# Altium schematic sheet Main_Board_Tank.SchDoc
size A4; SheetNumber: 1; SheetTotal: 4
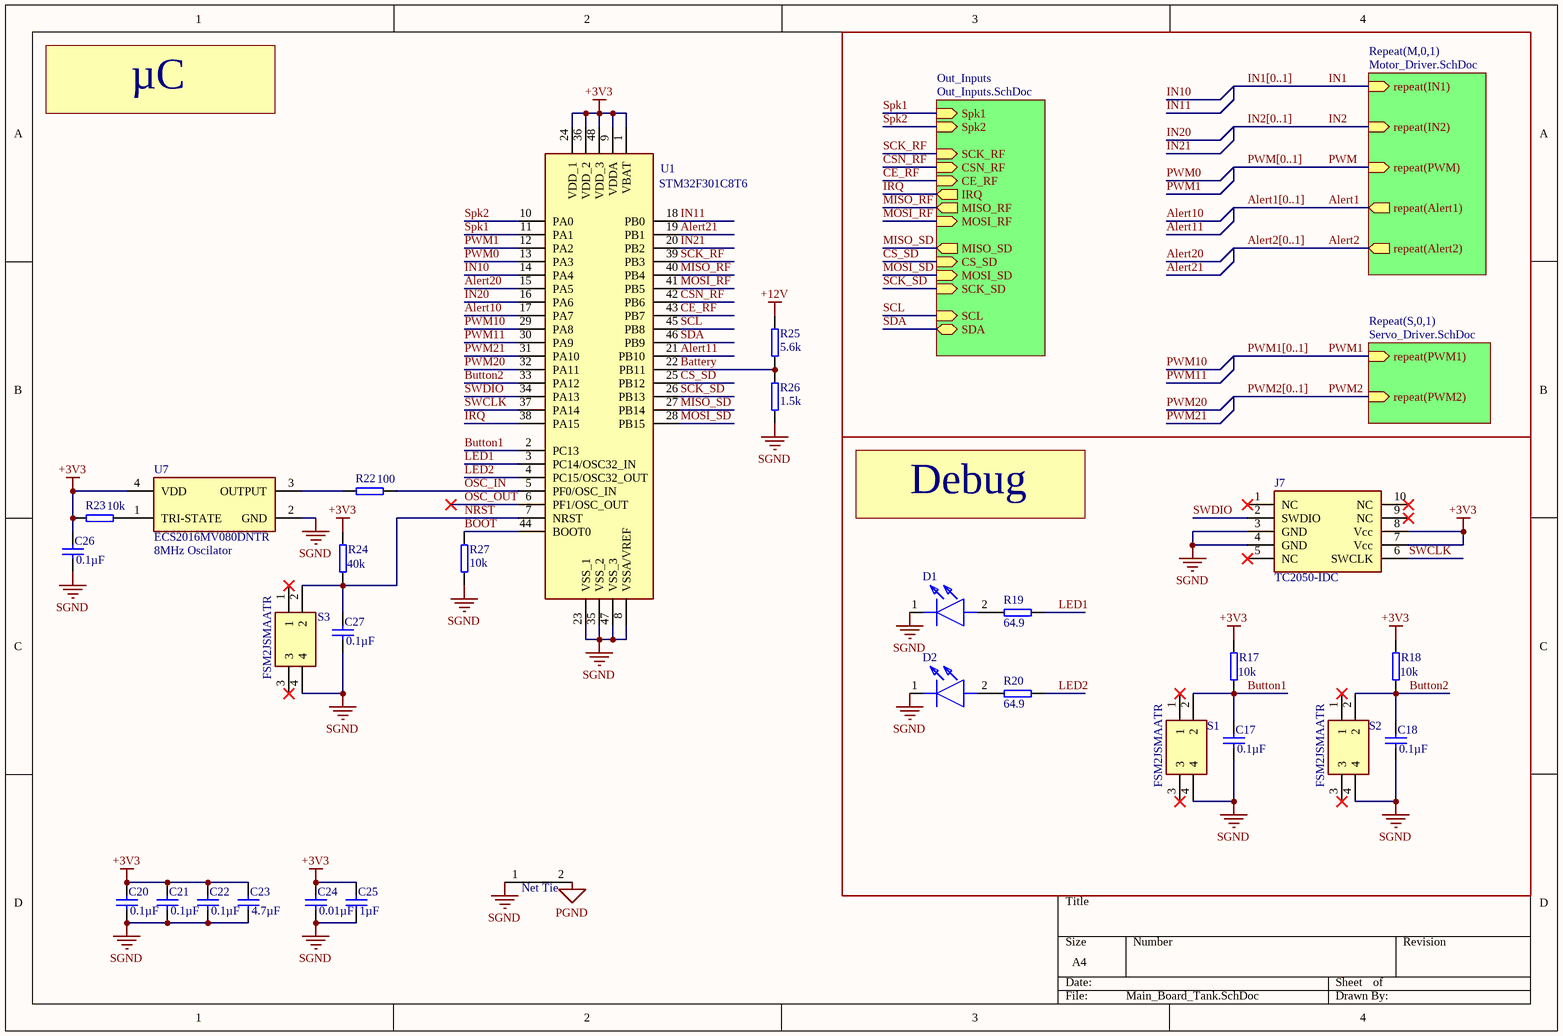
[diagram p0: Main_Board_Tank.SchDoc]

## Parts
C17  0.1µF  [Capacitor 0603]
C18  0.1µF  [Capacitor 0603]
C20  0.1µF  [Capacitor 0603]
C21  0.1µF  [Capacitor 0603]
C22  0.1µF  [Capacitor 0603]
C23  4.7µF  [Capacitor 0603]
C24  0.01µF  [Capacitor 0603]
C25  1µF  [Capacitor 0603]
C26  0.1µF  [Capacitor 0603]
C27  0.1µF  [Capacitor 0603]
D1  LED 1608 (0603) SMD  [INS21AT2G]  (value not drawn)
D2  LED 1608 (0603) SMD  [INS21AT2G]  (value not drawn)
J7  TC2050-IDC  [TAG-CONNECT_TC2050-IDC]
NT1  Net Tie  [Net_Tie]  (net tie, no BOM)
R17  10k  [Resistor 0603]
R18  10k  [Resistor 0603]
R19  64.9  [Resistor 0603]
R20  64.9  [Resistor 0603]
R22  100  [Resistor 0603]
R23  10k  [Resistor 0603]
R24  40k  [Resistor 0603]
R25  5.6k  [Resistor 0603]
R26  1.5k  [Resistor 0603]
R27  10k  [Resistor 0603]
S1  FSM2JSMAATR  [FSM2J_1]
S2  FSM2JSMAATR  [FSM2J_1]
S3  FSM2JSMAATR  [FSM2J_1]
U1  STM32F301C8T6  [QFP50P900X900X160-48N]
U7  ECS2016MV080DNTR  [OSC_ECS-1618-300-BN-TR]

## Blocks framed on the sheet
Debug: C17 C18 D1 D2 J7 R17-R20 S1 S2

## Sub-sheets
Out_Inputs = Out_Inputs.SchDoc: Spk1 (in), Spk2 (in), SCK_RF (in), CSN_RF (in), CE_RF (in), IRQ (out), MISO_RF (out), MOSI_RF (in), MISO_SD (out), CS_SD (in), MOSI_SD (in), SCK_SD (in), SDA (bidir), SCL (in)
Repeat(M,0,1) = Motor_Driver.SchDoc: repeat(IN2) (in), repeat(PWM) (in), repeat(IN1) (in), repeat(Alert1) (out), repeat(Alert2) (out)
Repeat(S,0,1) = Servo_Driver.SchDoc: repeat(PWM1) (in), repeat(PWM2) (in)

## Nets
+3V3: C20.1 C21.1 C22.1 C23.1 C24.1 C25.1 C26.1 J7.7(Vcc) J7.8(Vcc) R17.1 R18.1 R23.2 R24.1 U1.1(VBAT) U1.9(VDDA) U1.24(VDD_1) U1.36(VDD_2) U1.48(VDD_3) U7.4(VDD)
+12V: R25.2
PGND: NT1.2
SGND: C17.2 C18.2 C20.2 C21.2 C22.2 C23.2 C24.2 C25.2 C26.2 C27.2 D1.1(K) D2.1(K) J7.3(GND) J7.4(GND) NT1.1 R26.1 R27.1 S1.4 S2.4 S3.4 U1.8(VSSA/VREF) U1.23(VSS_1) U1.35(VSS_2) U1.47(VSS_3) U7.2(GND)
Alert1: sheet Repeat(M,0,1)/repeat(Alert1)
Alert2: sheet Repeat(M,0,1)/repeat(Alert2)
Alert10: U1.17(PA7)
Alert11: U1.21(PB10)
Alert20: U1.15(PA5)
Alert21: U1.19(PB1)
Battery: R25.1 R26.2 U1.22(PB11)
BOOT: R27.2 U1.44(BOOT0)
Button1: C17.1 R17.2 S1.2 U1.2(PC13)
Button2: C18.1 R18.2 S2.2 U1.33(PA12)
CE_RF: U1.43(PB7) ; sheet Out_Inputs/CE_RF
CS_SD: U1.25(PB12) ; sheet Out_Inputs/CS_SD
CSN_RF: U1.42(PB6) ; sheet Out_Inputs/CSN_RF
IN1: sheet Repeat(M,0,1)/repeat(IN1)
IN2: sheet Repeat(M,0,1)/repeat(IN2)
IN10: U1.14(PA4)
IN11: U1.18(PB0)
IN20: U1.16(PA6)
IN21: U1.20(PB2)
IRQ: U1.38(PA15) ; sheet Out_Inputs/IRQ
LED1: R19.1 U1.3(PC14/OSC32_IN)
LED2: R20.1 U1.4(PC15/OSC32_OUT)
MISO_RF: U1.40(PB4) ; sheet Out_Inputs/MISO_RF
MISO_SD: U1.27(PB14) ; sheet Out_Inputs/MISO_SD
MOSI_RF: U1.41(PB5) ; sheet Out_Inputs/MOSI_RF
MOSI_SD: U1.28(PB15) ; sheet Out_Inputs/MOSI_SD
NRST: C27.1 R24.2 S3.2 U1.7(NRST)
OSC_IN: R22.1 U1.5(PF0/OSC_IN)
OSC_OUT: U1.6(PF1/OSC_OUT)
PWM: sheet Repeat(M,0,1)/repeat(PWM)
PWM0: U1.13(PA3)
PWM1: U1.12(PA2) ; sheet Repeat(S,0,1)/repeat(PWM1)
PWM2: sheet Repeat(S,0,1)/repeat(PWM2)
PWM10: U1.29(PA8)
PWM11: U1.30(PA9)
PWM20: U1.32(PA11)
PWM21: U1.31(PA10)
SCK_RF: U1.39(PB3) ; sheet Out_Inputs/SCK_RF
SCK_SD: U1.26(PB13) ; sheet Out_Inputs/SCK_SD
SCL: U1.45(PB8) ; sheet Out_Inputs/SCL
SDA: U1.46(PB9) ; sheet Out_Inputs/SDA
Spk1: U1.11(PA1) ; sheet Out_Inputs/Spk1
Spk2: U1.10(PA0) ; sheet Out_Inputs/Spk2
SWCLK: J7.6(SWCLK) U1.37(PA14)
SWDIO: J7.2(SWDIO) U1.34(PA13)
NetD1_2: D1.2(A) R19.2
NetD2_2: D2.2(A) R20.2
NetR22_2: R22.2 U7.3(OUTPUT)
NetR23_1: R23.1 U7.1(TRI-STATE)

Not connected (* = marked no-connect by the designer): J7 1(NC)* 5(NC)* 9(NC)* 10(NC)*; S1 1* 3*; S2 1* 3*; S3 1* 3*

## Buses and harness runs
bus Alert1[0..1]
bus Alert2[0..1]
bus IN1[0..1]
bus IN2[0..1]
bus PWM1[0..1]
bus PWM2[0..1]
bus PWM[0..1]

## Notes on the sheet
- µC
- (near U7) 8MHz Oscilator

## Library data of the parts
C17 C18 C20-C27 = Capacitor 0603: Capacitor
J7 = TC2050-IDC: CBL PLUG-OF-NAILS 10-PIN W/LEGS; MF: Tag-Connect LLC; Package: None; Digi-Key_Part_Number: TC2050-IDC-ND; Value: *; MP: TC2050-IDC; SnapEDA_Link: https://www.snapeda.com/parts/TC2050-IDC/Tag-Connect%20LLC/view-part/134529/?ref=snap; Digi-Key_Purchase_URL: https://www.digikey.com/product-detail/en/tag-connect-llc/TC2050-IDC/TC2050-IDC-ND/2605366?utm_source=snapeda&utm_medium=aggregator&utm_campaign=symbol
R17-R20 R22-R27 = Resistor 0603: Resistor
S1-S3 = FSM2JSMAATR: Switch; Manufacturer_Name: TE Connectivity; Datasheet Link: http://www.te.com/commerce/DocumentDelivery/DDEController?Action=showdoc&DocId=Customer+Drawing%7F2-1437565-7%7FV%7Fpdf%7FEnglish%7FENG_CD_2-1437565-7_V.pdf%7F2-1437565-9; Manufacturer_Part_Number: FSM2JSMAATR; Mouser Part Number: 506-FSM2JSMAATR; Mouser Price/Stock: https://www.mouser.co.uk/ProductDetail/TE-Connectivity-Alcoswitch/FSM2JSMAATR?qs=g%252BEszo6zu8MKdISiZRITCQ%3D%3D; Arrow Part Number: FSM2JSMAATR; Arrow Price/Stock: https://www.arrow.com/en/products/fsm2jsmaatr/te-connectivity?region=nac
U1 = STM32F301C8T6: STMICROELECTRONICS - STM32F301C8T6 - MCU, 32BIT, CORTEX-M4, 72MHZ, LQFP-48; Geometry.Height: 1.6mm; Mouser Part Number: 511-STM32F301C8T6; Mouser Price/Stock: https://www.mouser.co.uk/ProductDetail/STMicroelectronics/STM32F301C8T6?qs=DqCdCwOw4%2F52bYCbIDWtEg%3D%3D; Manufacturer_Name: STMicroelectronics; Manufacturer_Part_Number: STM32F301C8T6; Datasheet Link: https://www.st.com/resource/en/datasheet/stm32f301c8.pdf
U7 = ECS-2016MV-250-CN-TR3: 25 MHz XO (Standard) HCMOS Oscillator 1.8V ~ 3.3V Enable/Disable 4-SMD, No Lead; MF: ECS Inc.; SnapEDA_Link: https://www.snapeda.com/parts/ECS-2016MV-250-CN-TR3/ECS+Inc./view-part/?ref=snap; Value: *; Purchase-URL: https://pricing.snapeda.com/search/part/ECS-2016MV-250-CN-TR3/?ref=eda; Check_prices: https://www.snapeda.com/parts/ECS-2016MV-250-CN-TR3/ECS+Inc./view-part/?ref=eda; Availability: In Stock; Price: None; MP: ECS-2016MV-250-CN-TR3; Package: None